# EAGLE design EcobitNRF9160 (EAGLE 9.1.0)
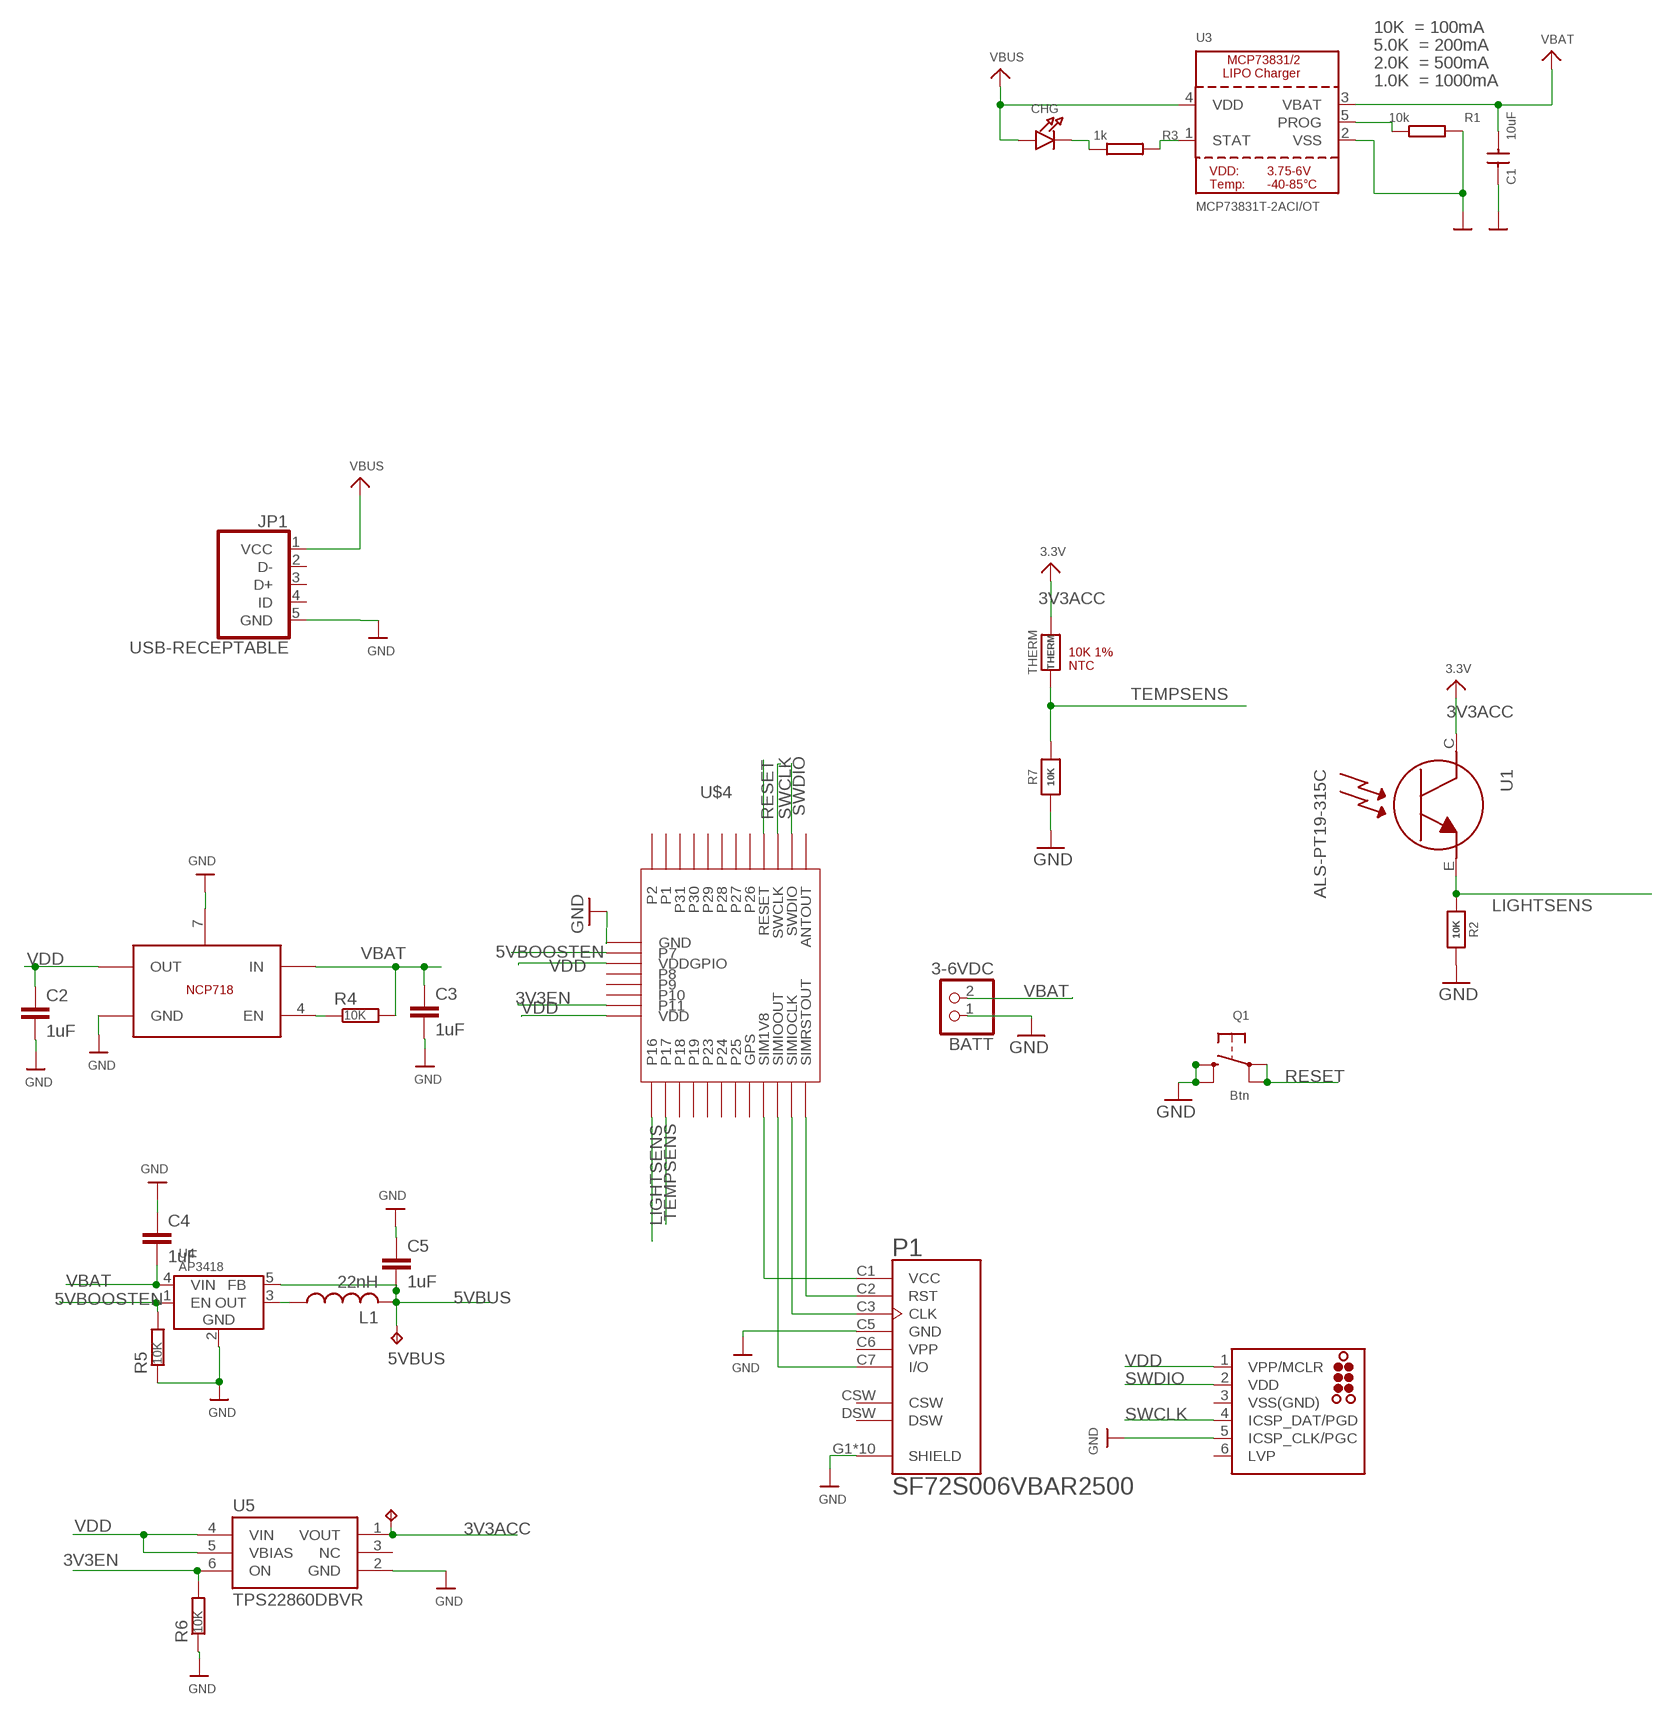
[diagram p0: schematic, sheet 1]

## Parts
5VBUS  TPTP15R  [TP15R]
5VBUS1  TPTP15R  [TP15R]
BATT  3-6VDC  CON_JST_PH_2PIN  [JSTPH2]
C1  10uF  CAP0402  [C-0402]
C2  1uF  CAPACITOR_0402_N  [RESC0402_N]
C3  1uF  CAPACITOR_0402_N  [RESC0402_N]
C4  1uF  CAPACITOR_0402_N  [RESC0402_N]
C5  1uF  CAPACITOR_0402_N  [RESC0402_N]
CHG  LED0805_NOOUTLINE  [CHIPLED_0805_NOOUTLINE]
J2  TC2030-MCP-NL  [TC2030-MCP-NL]
JP1  USB-RECEPTABLE  [FCI-10103594-0001LF]
L1  22nH  INDUCTOR_0603_N  [RESC0603_N]
P1  SF72S006VBAR2500  [JAE_SF72S006VBAR2500]
Q1  Btn  SWITCH_TACT_SMT4.6X2.8  [BTN_KMR2_4.6X2.8]
R1  10k  RESR0402  [R0402]
R2  10K  RESISTOR_0603_NOOUT  [0603-NO]
R3  1k  RESR0402  [R0402]
R4  10K  RESISTOR_0402_N  [RESC0402_N]
R5  10K  RESISTOR_0402_N  [RESC0402_N]
R6  10K  RESISTOR_0402_N  [RESC0402_N]
R7  10K  RESISTOR_0603_NOOUT  [0603-NO]
THERM  THERM  RESISTOR_0402  [_0402]
U1  ALS-PT19-315C  LIGHT_ALS-PT19-315C  [ALS-PT19-315C]
U2  NCP718  [NCP718-WDFN6]
U3  MCP73831T-2ACI/OT  MCP73831/2  [SOT23-5]
U4  AP3418  [SOT25]
U5  TPS22860DBVR  [R-PDSO-G6]
U$4  NRF9160MODULE  [NRF9160MODULE]

## Nets
3V3ACC: 5VBUS1.TP THERM.2 U1.C U5.1(VOUT) ; supply symbol labelled 3.3V
3V3EN: R6.2 U5.6(ON) U$4.P11
5VBOOSTEN: R5.2 U4.1(EN) U$4.P7
5VBUS: 5VBUS.TP C5.2 L1.2 U4.5(FB)
GND: BATT.1 C1.2 C2.2 C3.2 C4.1 C5.1 J2.5(ICSP_CLK/PGC) JP1.5(GND) P1.C5(GND) P1.G1(SHIELD) P1.G2(SHIELD) P1.G3(SHIELD) P1.G4(SHIELD) P1.G5(SHIELD) P1.G6(SHIELD) P1.G7(SHIELD) P1.G8(SHIELD) P1.G9(SHIELD) P1.G10(SHIELD) Q1.B'(S1) Q1.B(S) R1.1 R2.1 R5.1 R6.1 R7.1 U2.3(GND) U2.7(GND) U3.2(VSS) U4.2(GND) U5.2(GND) U$4.GND
LIGHTSENS: R2.2 U1.E U$4.P16
N$1: P1.C1(VCC) U$4.SIM1V8
N$2: L1.1 U4.3(OUT)
N$3: R3.1 U3.1(STAT)
N$4: CHG.C R3.2
N$5: P1.C2(RST) U$4.SIMRSTOUT
N$6: P1.C3(CLK) U$4.SIMCLKOUT(SIMIOCLK)
N$7: P1.C7(I/O) U$4.SIMIOOUT
N$10: R1.2 U3.5(PROG)
R-EN: R4.1 U2.4(EN)
RESET: Q1.A'(P1) Q1.A(P) U$4.RESET
SWCLK: J2.4(ICSP_DAT/PGD) U$4.SWCLK
SWDIO: J2.2(VDD) U$4.SWDIO
TEMPSENS: R7.2 THERM.1 U$4.P17
VBAT: BATT.2 C1.1 C3.1 C4.2 R4.2 U2.6(IN) U3.3(VBAT) U4.4(VIN)
VBUS: CHG.A JP1.1(VCC) U3.4(VDD)
VDD: C2.1 J2.1(VPP/MCLR) U2.1(OUT) U5.4(VIN) U5.5(VBIAS) U$4.VDD U$4.VDDGPIO
Unconnected: J2.6(LVP) JP1.2(D-) JP1.3(D+) JP1.4(ID) P1.CSW P1.DSW U5.3(NC) U$4.ANTOUT U$4.GPS U$4.P1 U$4.P2 U$4.P8 U$4.P9 U$4.P10 U$4.P18 U$4.P19 U$4.P23 U$4.P24 U$4.P25 U$4.P26 U$4.P27 U$4.P28 U$4.P29 U$4.P30 U$4.P31

## Notes on the sheet
- 10K  = 100mA
- 5.0K  = 200mA
- 2.0K  = 500mA
- 1.0K  = 1000mA
- 10K 1%
  NTC

## Power pins joined to a net without a drawn wire
VPP: P1.C6(VPP)
VSS(GND): J2.3(VSS(GND))

## Library data of the parts
5VBUS 5VBUS1 = testpad:TP: Test pad
BATT = microbuilder:CON_JST_PH_2PIN: JST 2-Pin Right-Angle Connector PH-Series - 4UConnector: 17311 SH-Series - 4UConnector: 07278
C1 = NANO2:CAP: CAP
C2-C5 = NordicMisc:CAPACITOR: Generic chip capacitor
CHG = microbuilder:LED: LED 0603 - 0603 Surface Mount Package 2mA: Green LED - Low Power (3.9mcd, 2ma, 1.7Vf) - Digikey: 475-2709-2-ND Orange LED - Low Power (9.8mcd, 2ma, 1.8Vf) - Digikey: 475-1194-2-ND Red LED - Low Power (5mcd, 2ma, 1.8Vf) - Digikey: 475-1195-2-ND Yellow LED - Low Power (7mcd, 2ma, 1.8Vf) - Digikey: 475-1196-2-ND 5mA: Blue LED - Low Power (17mcd, 5ma, 2.9Vf) - Digikey: LNJ937W8CRACT-ND 0805 - 0805 Surface Mount Package 2mA: Red LED (8.8mcd, 2mA, 1.8Vf, Clear) - Low Power [Digikey: 475-2510-1-ND] Green LED (5mcd, 2mA, 1.8Vf, Clear) - Low Power [Digikey: 475-2730-1-ND] Yellow LED (11.3mcd, 2mA, 1.8Vf, Clear) - Low Power [Digikey: 475-2555-1-ND] 20mA: Red LED (104mcd, 20mA, Diffused) - LS R976 [Digikey: 475-1278-6-ND] Red LED (12mcd, 20mA, 2.0Vf, Clear) - APT2012EC [Digikey: 754-1128-1-ND] Green LED (15mcd, 20mA, 2.2Vf, Clear) - APT2012GC [Digikey: 754-1131-1-ND] Orange LED (160mcd, 20mA, 2.1Vf, Clear) - APT2012SECK [Digikey: 754-1130-1-ND] 1206 - 1206 Surface Mount Package Green LED (26mcd, 20mA, Diffused) - LG N971 [Digikey: 475-1407-6-ND] Red LED (15mcd, 20mA, Diffused) - LH N974 [Digikey: 475-1416-6-ND] Cree - Cree High-Power Surface Mount LEDs XPEBWT-L1-0000-00D50 - White 111lm 350mA 2.9Vf 6200K 110° XTEAWT-00-0000-00000LEE3 - White 114lm 350mA 2.85Vf 5000K 115° Everlight - Everlight 45-21 Series Surface Mount LEDs 45-21/QK2C-B2832AC2CB2/2T - Warm White 2000mcd 20mA 3.25Vf 3050K 120° 45-21/LK2C-B38452C4CB2/2T - Nuetral White 2000mcd 20mA 3.25Vf 4150K 120° 45-21/LK2C-B50634C6CB2/2T - Cold White 2200mcd 20mA 3.25Vf 5650K 120° PLCC2 Reverse Mount LS T77K-J1L2-1-0-2-R18-Z - Red 11.25mcd 2mA 1.8Vf 630nm 120° LO T77K-L1M2-24-Z - Orange 19.6mcd 2mA 1.8Vf 606nm 120° LY T77K-K2M1-26-Z - Yellow 15.7mcd 2mA 1.8Vf 587nm 120°
J2 = tag-connect:TC2030: TAG-CONNECT ICSP Connector Manufacturer: Tag-Connect <http://www.tag-connect.com> Cable for easy In-Circuit Serial Programming. Designed for Microchip ICD2, suitable for many others. Two variants - one "with legs" (for hands-free fit on PCB) and another "without legs" for quick programming. PAD Description 1 MCLR/Vpp 2 Vdd 3 GND 4 PGD (ISPDAT) 5 PGC (ISPCLK) 6 nc (used for LVP) ©2009 ROFA.cz - modified and updated by Robert Darlington ‹rdarlington@gmail.com›
JP1 = daspilker MICROUSB:USB-RECEPTABLE: USB Receptable
L1 = NordicMisc:INDUCTOR: Generic chip inductor
P1 = SF72S006VBAR2500:SF72S006VBAR2500: SF72 series, nano-SIM card connector, normail open type, 6 connector; AVAILABILITY: Unavailable; DESCRIPTION: SF72 series, nano-SIM card connector, normail open type, 6 connector; MF: JAE Electronics; MP: SF72S006VBAR2500; PACKAGE: None; PRICE: None
Q1 = microbuilder:SWITCH_TACT_SMT: SMT Tact Switches 6x6mm - Digikey: P12940SCT-ND KMR2 (4.6x2.8mm) - Digikey: 401-1426-1-ND EVQ-PQHB55 - Light Touch, 160GF (4.5x4.5mm) - Digikey: P8090SCT-ND KMT0 - KMT021 NGJ LHS (etc.) IP68/Waterproof - Digikey: CKN10289CT-ND
R1 R3 = 1RedBeard:RES: RES
R2 R7 THERM = microbuilder:RESISTOR: Resistors For new designs, use the packages preceded by an '_' character since they are more reliable: The following footprints should be used on most boards: _0402 - Standard footprint for regular board layouts _0603 - Standard footprint for regular board layouts _0805 - Standard footprint for regular board layouts _1206 - Standard footprint for regular board layouts For extremely tight-pitch boards where space is at a premium, the following 'micro-pitch' footprints can be used (smaller pads, no silkscreen outline, etc.): _0402MP - Micro-pitch footprint for very dense/compact boards _0603MP - Micro-pitch footprint for very dense/compact boards _0805MP - Micro-pitch footprint for very dense/compact boards _1206MP - Micro-pitch footprint for very dense/compact boards
R4-R6 = NordicMisc:RESISTOR: Generic chip resistor
U1 = microbuilder:LIGHT_ALS-PT19-315C: ALS-PT19-315C - Analog Light Sensor VCC: 2.5-5.5V
U2 = NCP718 Low Dropout Regulator:NCP718
U3 = microbuilder:MCP73831/2: MCP73831/2 LIPO Charger VDD: 3.75 - 6V Temp -40 - 85°C Programmable Charge Rate: 15-500mA NOTE: STAT is a tri-state logic output on the MCP73831 and an open-drain output on the MCP73832. SOT23-5 with 4.2V output and tri-state logic on STAT = MCP73831T-2ACI/OT
U4 = AP3418 3v3 to 5V DCDC Booster:AP3418
U5 = TexasCustom:TPS22860DBVR: Power Switch ICs - Power Distribution TPS22860 Ultra-low leakage load switch 6-SOT-23 -40 to 85
U$4 = switch-ck:NRF9160MODULE

## Net classes
0 default: clearance 0.205 mm

## Board
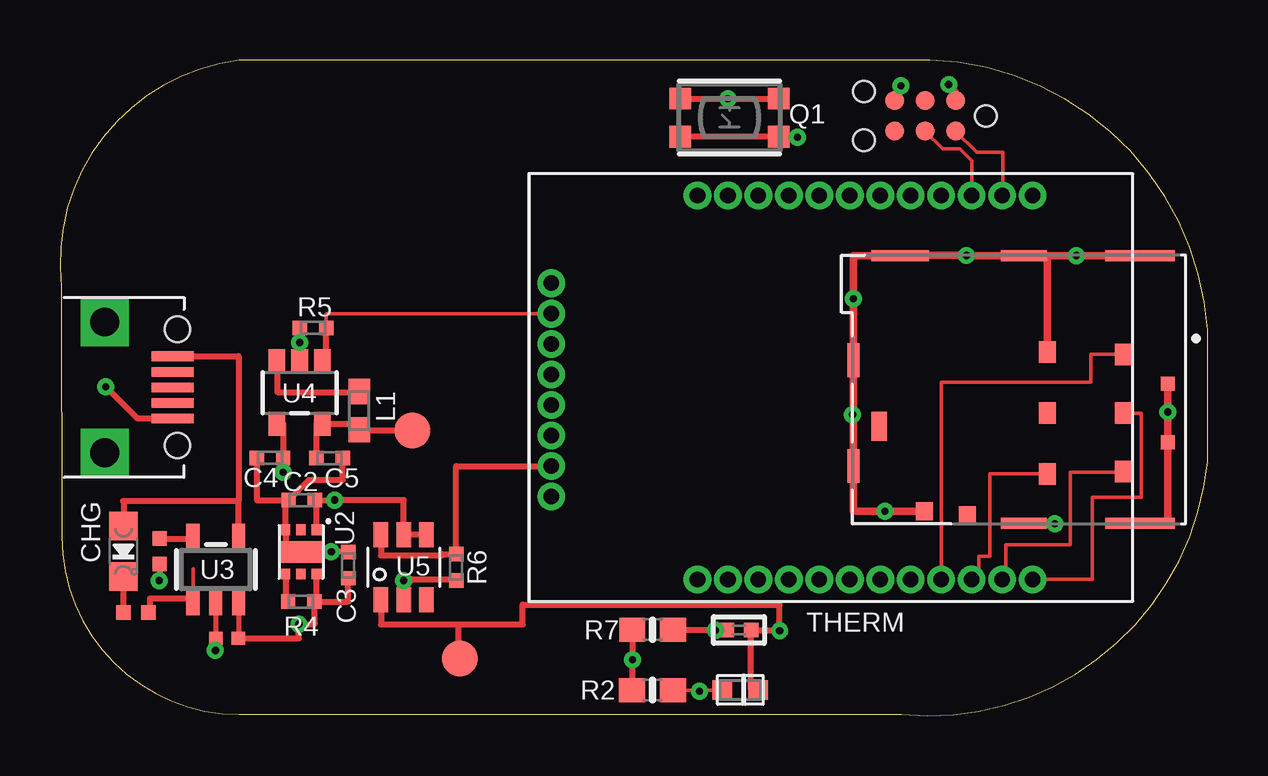
[diagram p1: board, top side]
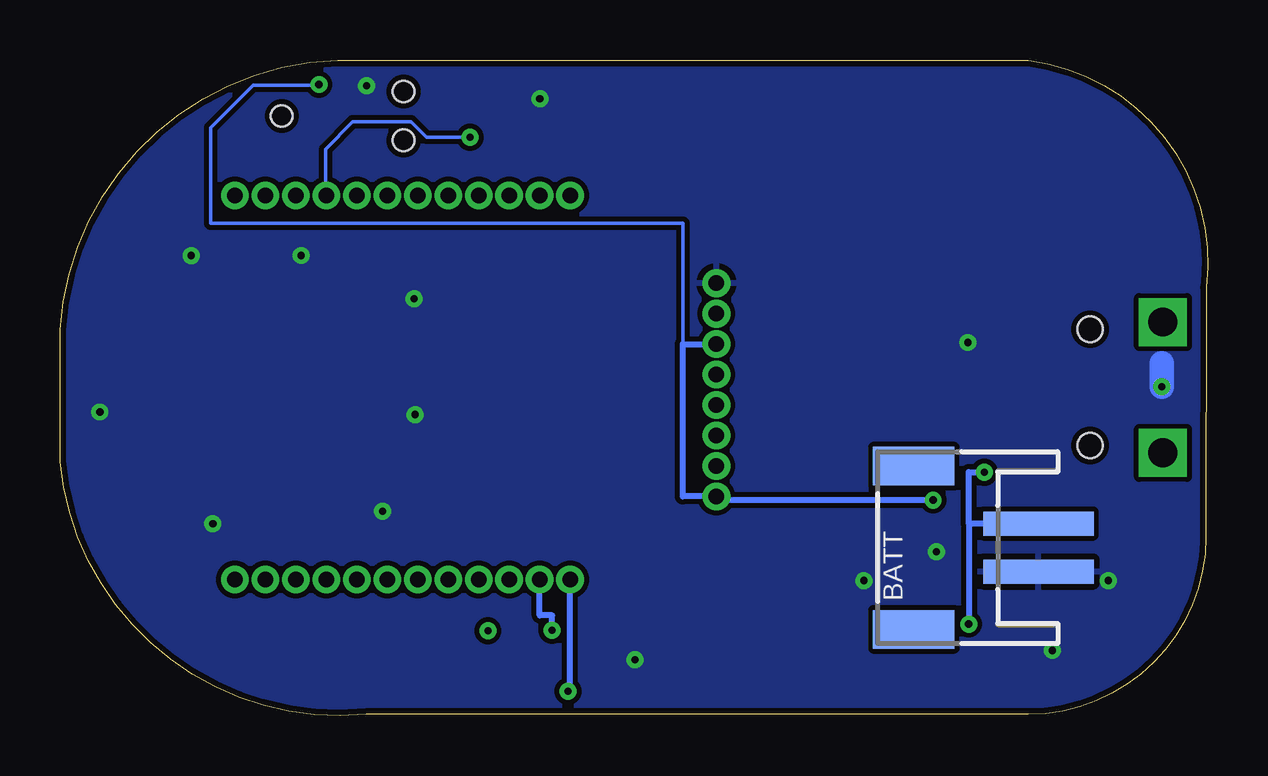
[diagram p2: board, bottom side, seen from below]

Size 47.84 x 27.32 mm. Coordinates in mm from the lower left corner, seen from the top.
Outline: 0.06,17.85 0.07,7.45 arc90 7.48,0.05 35.08,0.05 arc90 47.84,10.59 47.84,16.08 arc90 35.08,27.3 7.48,27.3 arc90 0.06,17.85
Copper layers (1*16): Top 0.035mm / dielectric 1.5mm / Bottom 0.035mm
Design rules "default *": minimum track width 6mil, minimum drill 0.3mm, track to track 6mil, track to pad 6mil, pad to pad 6mil, via to via 6mil, smd to smd 0mil, copper to edge 10mil, drill to drill 6mil, minimum pad ring 10mil, minimum via ring 8mil, stop-mask expansion 4mil, vias tented up to drill 0mil, thermal gap 10mil

### Footprints (pad centres in the part's own frame; a part is rotated, then mirrored left to right if it is on the bottom)
TP15R = smd 1.5 x 1.5: TP 0,0
JSTPH2 = smd 1 x 4.6: 1 -1,-3.7; 2 1,-3.7 | smd 1.6 x 3.4: NC1 -3.4,1.5; NC2 3.4,1.5
C-0402 = smd 0.55 x 0.55: 1 -0.47,0; 2 0.47,0
RESC0402_N = smd 0.6 x 0.6: 1 -0.55,0; 2 0.55,0
CHIPLED_0805_NOOUTLINE = smd 1.2 x 1.2: A 0,-1.05; C 0,1.05
TC2030-MCP-NL = smd 0.787 x 0.787: 1 1.27,-0.635; 2 1.27,0.635; 3 2.54,-0.635; 4 2.54,0.635; 5 3.81,-0.635; 6 3.81,0.635 | hole 0.889: 0,0; 5.08,-1.016; 5.08,1.016
FCI-10103594-0001LF = smd 0.4 x 1.75: 1 -1.3,4.525; 2 -0.65,4.525; 3 0,4.525; 4 0.65,4.525; 5 1.3,4.525 | drill 1.2 pad 2 square: P$3 -2.725,1.7; P$4 2.725,1.7 | hole 1.05: -2.425,4.73; 2.425,4.73
RESC0603_N = smd 1.05 x 0.9: 1 -0.8,0; 2 0.8,0
JAE_SF72S006VBAR2500 = smd 0.9 x 0.7: C1 2.44,-4.575; C2 0,-4.575; C3 -2.44,-4.575; C5 2.54,-1.405; C6 0,-1.405; C7 -2.54,-1.405 | smd 0.7 x 0.7: CSW -4.245,1.925 | smd 1.2 x 0.65: DSW -0.55,5.6 | smd 0.45 x 2.9: G1 -4.595,-5.275; G8 6.555,-5.275 | smd 0.45 x 1.9: G2 -4.595,-0.425; G7 6.555,-0.425 | smd 0.75 x 0.7: G3 -4.095,3.725 | smd 1.4 x 0.5: G4 -2.2,6.675; G5 2.2,6.675 | smd 0.45 x 2.4: G6 6.555,4.725 | smd 0.6 x 0.6: G9 1.22,-6.425; G10 -1.22,-6.425
BTN_KMR2_4.6X2.8 = smd 0.9 x 0.9: A 2.05,0.8; A' -2.05,0.8; B 2.05,-0.8; B' -2.05,-0.8
R0402 = smd 0.6 x 0.6: 1 -0.525,0; 2 0.525,0
0603-NO = smd 1.075 x 1: 1 -0.85,0; 2 0.85,0
_0402 = smd 0.6 x 0.6: 1 -0.508,0; 2 0.508,0
ALS-PT19-315C = smd 0.8 x 0.8: C -0.75,0; E 0.75,0
NCP718-WDFN6 = smd 0.4 x 0.45: 1 0.65,0.925; 2 0,0.925; 3 -0.65,0.925; 4 -0.65,-0.925; 5 0,-0.925; 6 0.65,-0.925 | smd 1.72 x 0.9: 7 0,0
SOT23-5 = smd 0.55 x 1.2: 1 -0.95,-1.3; 2 0,-1.3; 3 0.95,-1.3; 4 0.95,1.3; 5 -0.95,1.3
SOT25 = smd 1 x 0.7: 1 -1.3,0.95; 2 -1.3,0; 3 -1.3,-0.95; 4 1.3,-0.95; 5 1.3,0.95
R-PDSO-G6 = smd 0.6 x 1.05: 1 -0.95,-1.35; 2 0,-1.35; 3 0.95,-1.35; 4 0.95,1.35; 5 0,1.35; 6 -0.95,1.35
NRF9160MODULE = drill 0.65: ANTOUT 20.985,16.9; GND 0.92,13.245; GPS 15.905,0.9; P1 8.285,16.9; P2 7.015,16.9; P7 0.92,11.975; P8 0.92,9.435; P9 0.92,8.165; P10 0.92,6.895; P11 0.92,5.625; P16 7.015,0.9; P17 8.285,0.9; P18 9.555,0.9; P19 10.825,0.9; P23 12.095,0.9; P24 13.365,0.9; P25 14.635,0.9; P26 15.905,16.9; P27 14.635,16.9; P28 13.365,16.9; P29 12.095,16.9; P30 10.825,16.9; P31 9.555,16.9; RESET 17.175,16.9; SIM1V8 17.175,0.9; SIMCLKOUT 19.715,0.9; SIMIOOUT 18.445,0.9; SIMRSTOUT 20.985,0.9; SWCLK 18.445,16.9; SWDIO 19.715,16.9; VDD 0.92,4.355; VDDGPIO 0.92,10.705

### Placement (x,y rotation side)
5VBUS  14.69,11.89 0 top
5VBUS1  16.66,2.37 0 top
BATT  10.75,7 90 bottom
C1  6.97,3.22 180 top
C2  10.08,8.99 180 top
C3  12.02,6.28 90 top
C4  8.75,10.74 0 top
C5  11.24,10.73 180 top
CHG  2.65,6.85 180 top
J2  38.59,24.99 180 top
JP1  0.17,13.68 270 top
L1  12.47,12.71 270 top
P1  39.75,12.61 90 top
Q1  27.91,24.92 180 top
R1  4.16,6.85 90 top
R2  24.7,1.07 0 top
R3  3.17,4.29 180 top
R4  10.06,4.75 0 top
R5  10.55,16.16 0 top
R6  16.52,6.18 90 top
R7  24.71,3.58 0 top
THERM  28.3,3.57 0 top
U1  28.36,1.07 180 top
U2  10.05,6.83 0 top
U3  6.49,6.09 0 top
U4  9.99,13.46 270 top
U5  14.33,6.19 0 top
U$4  19.56,4.78 0 top

### Tracks (layer width: path | path; a pad name or v marks a point on that pad's centre or on a via)
3V3ACC  (via drill 0.3)
  Top 0.254: U5.1 13.38,3.8 16.62,3.8 | 16.62,3.8 19.29,3.8 19.29,4.62 20.48,4.62 30,4.62 v30,3.54 28.81,3.54 | 28.81,3.54 THERM.2 | U1.C 28.81,1.07 28.81,3.54 | 5VBUS1.TP 16.62,2.37 16.62,3.8
3V3EN
  Top 0.254: U5.6 13.38,6.68 15.91,6.68 15.91,6.73 R6.2 16.52,10.4 U$4.P11
5VBOOSTEN
  Top 0.152: R5.2 11.1,16.75 U$4.P7
  Top 0.254: U4.1 11.1,14.76 R5.2
5VBUS
  Top 0.254: C5.2 10.69,12.16 U4.5 12.47,12.16 L1.2 12.47,11.89 5VBUS.TP
GND  (via drill 0.3)
  Top 0.152: C1.2 6.5,2.72 v6.48,2.72 | R7.1 | J2.5 34.78,25.97 v35.05,26.24
  Top 0.203: U3.2 C1.2
  Top 0.254: JP1.5 3.24,12.38 v1.91,13.71 | v6.49,2.72 v6.48,2.72 | R1.1 4.16,5.63 v4.14,5.63 | C2.2 9.4,8.85 U2.3 9.4,6.83 U2.7 v11.31,6.83 | C3.2 v11.31,6.83 | v11.31,6.83 | Q1.B 25.87,25.71 v27.84,25.71 29.94,25.71 Q1.B' | R7.1 v23.86,2.33 | v23.86,2.33 v23.87,2.33 | R2.1 v23.86,2.33 | R5.1 v9.99,15.55 | U4.2 v9.99,15.55 | v9.99,15.55 | C4.1 8.2,8.99 C2.2 | C2.2 10.37,9.82 11.8,9.82 11.79,9.83 C5.1 | U5.2 v14.33,5.63 14.65,5.63 14.65,5.69 16.52,5.69 R6.1
  Top 0.305: P1.G8 v42.37,19.17 | v42.37,19.17 | 41.19,19.17 P1.G7 v37.79,19.17 v37.79,19.18 35.02,19.18 P1.G6 33.07,19.17 v33.07,17.37 P1.G5 | 41.19,19.17 v42.37,19.17 | P1.C5 41.15,19.17 41.19,19.17 | P1.G5 | P1.G9 v46.17,12.65 | v46.17,12.65 | v46.17,12.65 P1.G10 46.17,8.02 P1.G1 | P1.G2 41.46,8.02 v41.46,8 | P1.G3 v34.39,8.52 33.07,8.52 P1.G4 33.07,12.55 | P1.G5 33.07,12.55 | 33.07,12.55 v33.04,12.55
  Bottom 1.016: v1.91,13.71 1.91,14.69
  pour Bottom: 47.93,27.51 47.93,-0.3 -0.18,-0.3 -0.18,4.46 -0.17,4.46 -0.17,27.43
LIGHTSENS  (via drill 0.3)
  Top 0.152: R2.2 26.66,1.07 | 26.66,1.07 v26.66,1.01 | U1.E 26.66,1.07
  Bottom 0.254: v26.66,1.01 26.57,1.01 U$4.P16
N$1
  Top 0.152: U$4.SIM1V8 36.73,13.89 42.97,13.89 42.97,15.05 P1.C1
N$2
  Top 0.254: U4.3 9.06,14.76 9.06,13.49 12.47,13.49 L1.1
N$3
  Top 0.152: U3.1 5.54,6.12 | 3.77,4.37 R3.1
  Top 0.254: R3.1 3.75,4.29 3.75,4.89 5.54,4.89 U3.1
N$4
  Top 0.152: R3.2 2.63,4.29
  Top 0.254: CHG.C R3.2
N$5
  Top 0.152: U$4.SIMRSTOUT 43.04,5.68 43.04,9.11 45.07,9.11 45.07,12.61 P1.C2
N$6
  Top 0.152: U$4.SIMCLKOUT 39.42,5.68 39.42,7.12 42.11,7.12 42.11,10.15 44.32,10.15 P1.C3
N$7
  Top 0.152: U$4.SIMIOOUT 38.31,5.68 38.31,6.64 38.75,6.64 38.75,10.08 P1.C7
N$10
  Top 0.254: R1.2 5.54,7.38 U3.5
R-EN
  Top 0.254: U2.4 9.4,4.87 R4.1
RESET  (via drill 0.3)
  Top 0.152: Q1.A' 30.72,24.12 v30.74,24.1
  Top 0.254: Q1.A' Q1.A
  Bottom 0.152: v30.74,24.1 32.55,24.1 33.19,24.75 35.64,24.75 36.77,23.61 36.77,21.72 U$4.RESET
SWCLK
  Top 0.152: J2.4 36.79,23.62 37.51,23.62 38,23.12 U$4.SWCLK
SWDIO
  Top 0.152: J2.2 38.21,23.47 39.3,23.47 39.3,21.71 U$4.SWDIO
TEMPSENS  (via drill 0.3)
  Top 0.152: THERM.1 | R7.2 25.57,3.57
  Top 0.254: R7.2 27.32,3.59 | 27.32,3.59 v27.32,3.56 | THERM.1 v27.32,3.57 27.32,3.59
  Bottom 0.254: v27.32,3.56 27.32,4.18 27.84,4.18 U$4.P17
VBAT  (via drill 0.3)
  Top 0.203: U3.3 C1.1
  Top 0.254: U3.3 7.46,4.77 | 7.44,3.2 C1.1 | R4.2 10.7,4.84 U2.6 | R4.2 12.02,4.76 C3.1 | 10.62,3.85 10.61,3.85 | 10.61,3.85 R4.2 | C1.1 9.96,3.22 v9.96,3.82 10.61,3.82 10.61,3.85 | U4.4 9.3,12.16 C4.2 v9.3,10.14 v9.31,10.14
  Bottom 0.254: BATT.2 9.96,8 | 9.96,8 v9.96,3.82 | 9.96,8 9.96,10.14 v9.31,10.14
VBUS
  Top 0.254: 7.47,7.42 U3.4 7.44,8.94 | 7.44,8.94 2.65,8.94 | 2.63,8.94 2.65,8.94 | 2.65,8.94 CHG.A | JP1.1 7.44,14.98 7.44,8.94
VDD  (via drill 0.3)
  Top 0.254: U2.1 10.7,8.92 C2.1 v11.44,8.99 | v11.44,8.99 v11.44,8.98 | J2.1 37.32,26.02 v37.04,26.3 | U5.4 U5.5 14.33,8.99 v11.44,8.99
  Bottom 0.152: 25.51,20.51 25.56,20.51 | 25.56,20.51 41.55,20.51 41.55,24.49 39.78,26.26 39.78,26.27 39.77,26.27 37.07,26.27 v37.04,26.3 | 25.56,20.51 21.87,20.51 21.87,15.48
  Bottom 0.254: v11.44,8.98 19.36,8.98 20.48,8.98 U$4.VDD 21.87,9.13 21.87,15.48 U$4.VDDGPIO